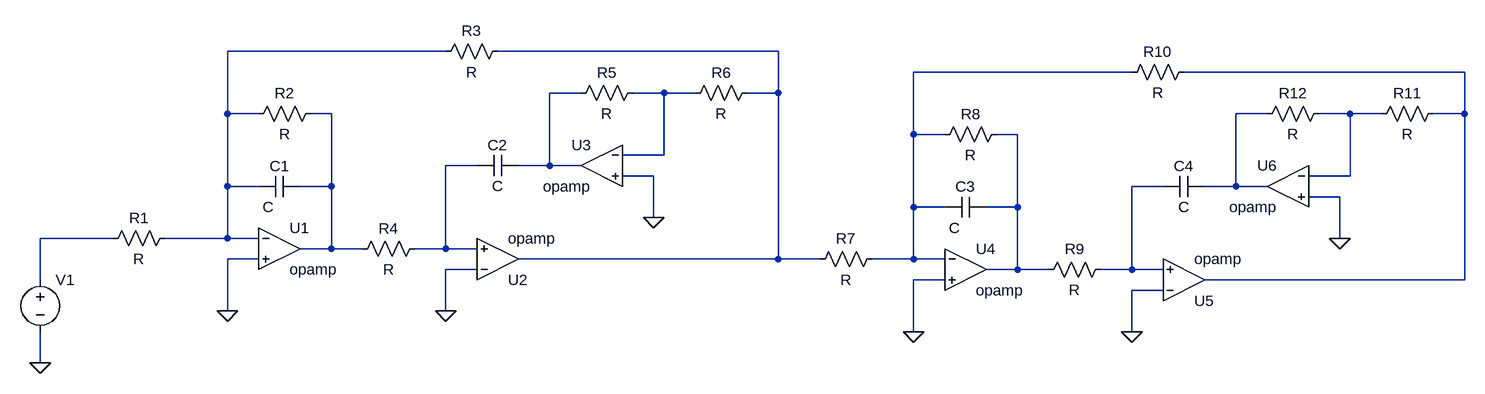
[diagram p0: schematic Laboratorio1_Normalizado.asc]
Laboratorio1_Normalizado.asc, the LTspice schematic file:
Version 4.1
SHEET 1 2116 1024
WIRE 336 -80 0 -80
WIRE 848 -80 416 -80
WIRE 1392 -48 1056 -48
WIRE 1904 -48 1472 -48
WIRE 544 -16 496 -16
WIRE 672 -16 624 -16
WIRE 720 -16 672 -16
WIRE 848 -16 848 -80
WIRE 848 -16 800 -16
WIRE 0 16 0 -80
WIRE 48 16 0 16
WIRE 160 16 128 16
WIRE 1600 16 1552 16
WIRE 1728 16 1680 16
WIRE 1776 16 1728 16
WIRE 1904 16 1904 -48
WIRE 1904 16 1856 16
WIRE 1056 48 1056 -48
WIRE 1104 48 1056 48
WIRE 1216 48 1184 48
WIRE 672 80 672 -16
WIRE 672 80 608 80
WIRE 384 96 336 96
WIRE 496 96 496 -16
WIRE 496 96 448 96
WIRE 544 96 496 96
WIRE 656 112 608 112
WIRE 1728 112 1728 16
WIRE 1728 112 1664 112
WIRE 0 128 0 16
WIRE 48 128 0 128
WIRE 160 128 160 16
WIRE 160 128 112 128
WIRE 1440 128 1392 128
WIRE 1552 128 1552 16
WIRE 1552 128 1504 128
WIRE 1600 128 1552 128
WIRE 1712 144 1664 144
WIRE 1056 160 1056 48
WIRE 1104 160 1056 160
WIRE 1216 160 1216 48
WIRE 1216 160 1168 160
WIRE 656 176 656 112
WIRE -176 208 -288 208
WIRE 0 208 0 128
WIRE 0 208 -96 208
WIRE 48 208 0 208
WIRE 1712 208 1712 144
WIRE 160 224 160 128
WIRE 160 224 112 224
WIRE 208 224 160 224
WIRE 336 224 336 96
WIRE 336 224 288 224
WIRE 384 224 336 224
WIRE 48 240 0 240
WIRE 848 240 848 -16
WIRE 848 240 448 240
WIRE 912 240 848 240
WIRE 1056 240 1056 160
WIRE 1056 240 992 240
WIRE 1104 240 1056 240
WIRE 384 256 336 256
WIRE 1216 256 1216 160
WIRE 1216 256 1168 256
WIRE 1264 256 1216 256
WIRE 1392 256 1392 128
WIRE 1392 256 1344 256
WIRE 1440 256 1392 256
WIRE -288 272 -288 208
WIRE 1104 272 1056 272
WIRE 1904 272 1904 16
WIRE 1904 272 1504 272
WIRE 1440 288 1392 288
WIRE 0 320 0 240
WIRE 336 320 336 256
WIRE 1056 352 1056 272
WIRE 1392 352 1392 288
WIRE -288 400 -288 352
FLAG 0 320 0
FLAG 336 320 0
FLAG -288 400 0
FLAG 656 176 0
FLAG 1056 352 0
FLAG 1392 352 0
FLAG 1712 208 0
SYMBOL res -80 192 R90
WINDOW 0 0 56 VBottom 2
WINDOW 3 32 56 VTop 2
SYMATTR InstName R1
SYMBOL res 144 0 R90
WINDOW 0 0 56 VBottom 2
WINDOW 3 32 56 VTop 2
SYMATTR InstName R2
SYMBOL res 304 208 R90
WINDOW 0 0 56 VBottom 2
WINDOW 3 32 56 VTop 2
SYMATTR InstName R4
SYMBOL res 432 -96 R90
WINDOW 0 0 56 VBottom 2
WINDOW 3 32 56 VTop 2
SYMATTR InstName R3
SYMBOL res 816 -32 R90
WINDOW 0 0 56 VBottom 2
WINDOW 3 32 56 VTop 2
SYMATTR InstName R6
SYMBOL res 640 -32 R90
WINDOW 0 0 56 VBottom 2
WINDOW 3 32 56 VTop 2
SYMATTR InstName R5
SYMBOL cap 112 112 R90
WINDOW 0 0 32 VBottom 2
WINDOW 3 32 49 VTop 2
SYMATTR InstName C1
SYMBOL cap 448 80 R90
WINDOW 0 0 32 VBottom 2
WINDOW 3 32 32 VTop 2
SYMATTR InstName C2
SYMBOL voltage -288 256 R0
WINDOW 123 24 124 Left 2
WINDOW 39 24 44 Left 2
WINDOW 3 24 72 Left 2
SYMATTR Value ""
SYMATTR InstName V1
SYMBOL OpAmps\\opamp 80 160 R0
SYMATTR InstName U1
SYMBOL OpAmps\\opamp 416 304 M180
SYMATTR InstName U2
SYMBOL OpAmps\\opamp 576 32 M0
SYMATTR InstName U3
SYMBOL res 1008 224 R90
WINDOW 0 0 56 VBottom 2
WINDOW 3 32 56 VTop 2
SYMATTR InstName R7
SYMBOL res 1200 32 R90
WINDOW 0 0 56 VBottom 2
WINDOW 3 32 56 VTop 2
SYMATTR InstName R8
SYMBOL res 1360 240 R90
WINDOW 0 0 56 VBottom 2
WINDOW 3 32 56 VTop 2
SYMATTR InstName R9
SYMBOL res 1488 -64 R90
WINDOW 0 0 56 VBottom 2
WINDOW 3 32 56 VTop 2
SYMATTR InstName R10
SYMBOL res 1872 0 R90
WINDOW 0 0 56 VBottom 2
WINDOW 3 32 56 VTop 2
SYMATTR InstName R11
SYMBOL res 1696 0 R90
WINDOW 0 0 56 VBottom 2
WINDOW 3 32 56 VTop 2
SYMATTR InstName R12
SYMBOL cap 1168 144 R90
WINDOW 0 0 32 VBottom 2
WINDOW 3 32 49 VTop 2
SYMATTR InstName C3
SYMBOL cap 1504 112 R90
WINDOW 0 0 32 VBottom 2
WINDOW 3 32 32 VTop 2
SYMATTR InstName C4
SYMBOL OpAmps\\opamp 1136 192 R0
SYMATTR InstName U4
SYMBOL OpAmps\\opamp 1472 336 M180
SYMATTR InstName U5
SYMBOL OpAmps\\opamp 1632 64 M0
SYMATTR InstName U6

The netlist it stands for:
* Laboratorio1_Normalizado.asc
R1 N001 N013 R
R2 N007 N001 R
R4 N011 N007 R
R3 N002 N001 R
R6 N002 N006 R
R5 N006 N005 R
C1 N007 N001 C
C2 N005 N011 C
V1 N013 0
X§U1 N001 0 N007 opamp Aol=100K GBW=10Meg  ; pins invin noninvin out
X§U2 0 N011 N002 opamp Aol=100K GBW=10Meg  ; pins invin noninvin out
X§U3 N006 0 N005 opamp Aol=100K GBW=10Meg  ; pins invin noninvin out
R7 N003 N002 R
R8 N010 N003 R
R9 N012 N010 R
R10 N004 N003 R
R11 N004 N009 R
R12 N009 N008 R
C3 N010 N003 C
C4 N008 N012 C
X§U4 N003 0 N010 opamp Aol=100K GBW=10Meg  ; pins invin noninvin out
X§U5 0 N012 N004 opamp Aol=100K GBW=10Meg  ; pins invin noninvin out
X§U6 N009 0 N008 opamp Aol=100K GBW=10Meg  ; pins invin noninvin out
.backanno
.end